# Altium schematic sheet DW1000.SchDoc
size A4
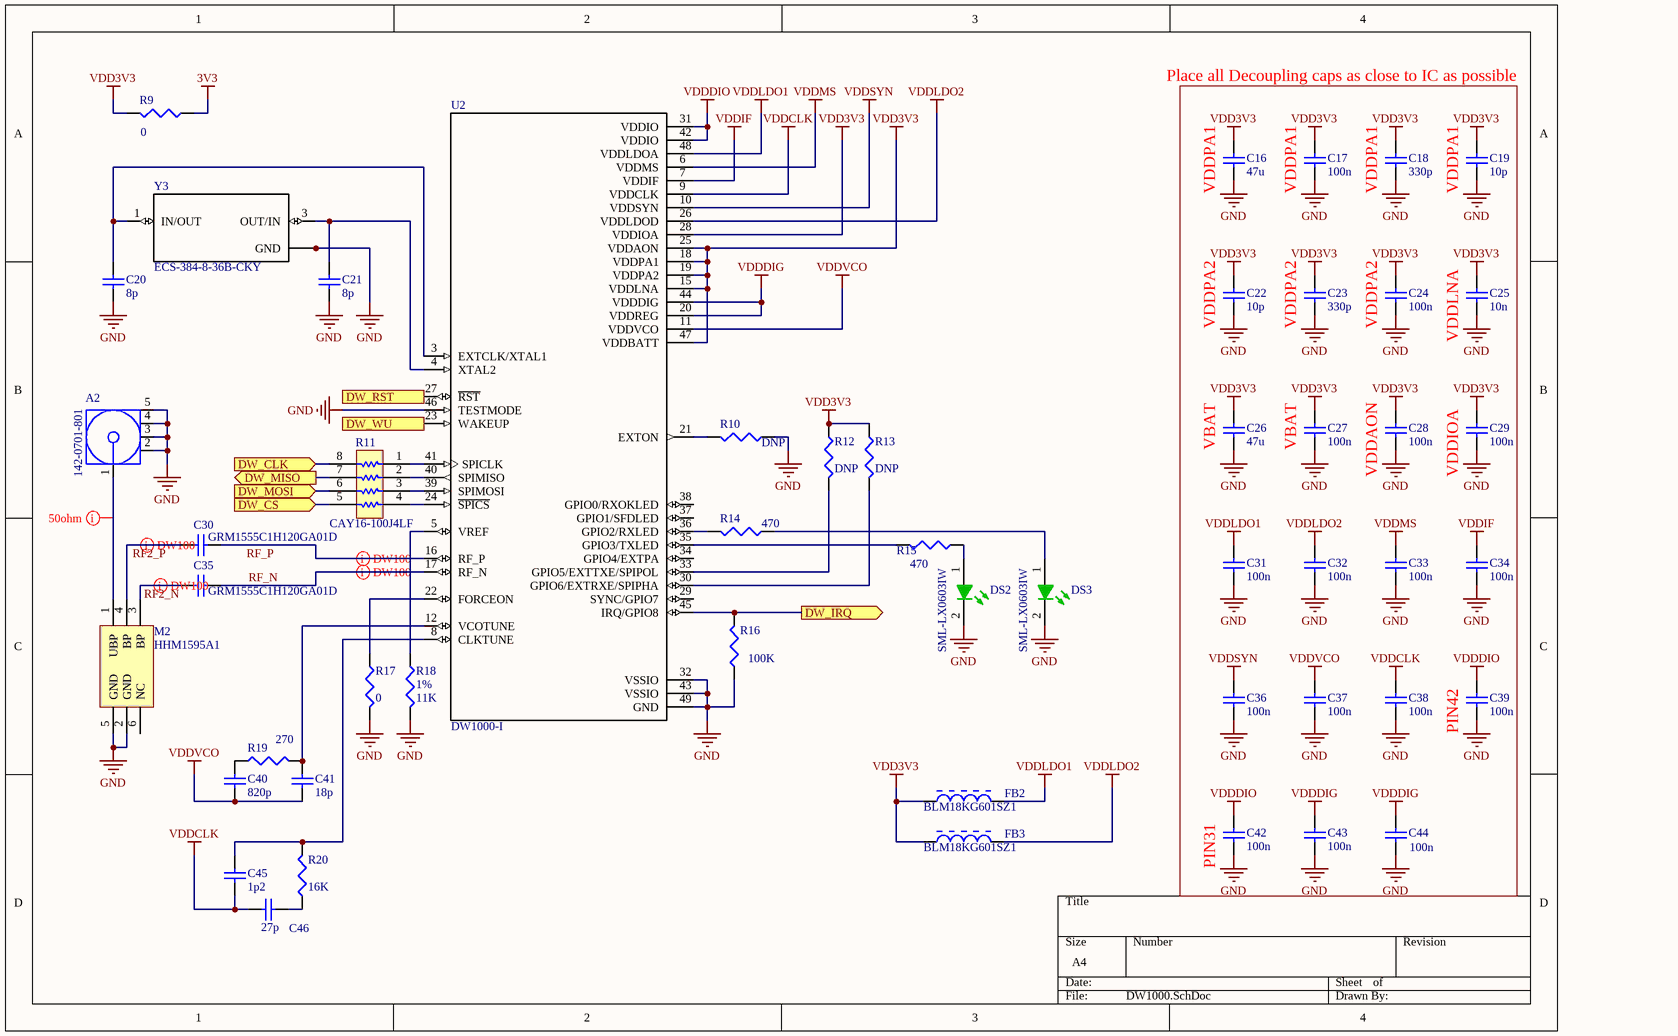
[diagram p0: DW1000.SchDoc]

## Parts
A2  142-0701-801  [CINC-142-0701-801_V]
C16  47u  [CAPC1608X90X35NL10T15]
C17  100n  [CAPC1608X90X35NL10T15]
C18  330p  [CAPC1608X90X35NL10T15]
C19  10p  [CAPC1608X90X35NL10T15]
C20  8p  [CAPC1608X90X35NL10T15]
C21  8p  [CAPC1608X90X35NL10T15]
C22  10p  [CAPC1608X90X35NL10T15]
C23  330p  [CAPC1608X90X35NL10T15]
C24  100n  [CAPC1608X90X35NL10T15]
C25  10n  [CAPC1608X90X35NL10T15]
C26  47u  [CAPC1608X90X35NL10T15]
C27  100n  [CAPC1608X90X35NL10T15]
C28  100n  [CAPC1608X90X35NL10T15]
C29  100n  [CAPC1608X90X35NL10T15]
C30  GRM1555C1H120GA01D  [CAPC1005X55X25ML05T10]
C31  100n  [CAPC1608X90X35NL10T15]
C32  100n  [CAPC1608X90X35NL10T15]
C33  100n  [CAPC1608X90X35NL10T15]
C34  100n  [CAPC1608X90X35NL10T15]
C35  GRM1555C1H120GA01D  [CAPC1005X55X25ML05T10]
C36  100n  [CAPC1608X90X35NL10T15]
C37  100n  [CAPC1608X90X35NL10T15]
C38  100n  [CAPC1608X90X35NL10T15]
C39  100n  [CAPC1608X90X35NL10T15]
C40  820p  [CAPC1608X90X35NL10T15]
C41  18p  [CAPC1608X90X35NL10T15]
C42  100n  [CAPC1608X90X35NL10T15]
C43  100n  [CAPC1608X90X35NL10T15]
C44  100n  [CAPC1608X90X35NL10T15]
C45  1p2  [CAPC1608X90X35NL10T15]
C46  27p  [CAPC1608X90X35NL10T15]
DS2  SML-LX0603IW  [KING-0603LED_GREEN_V]
DS3  SML-LX0603IW  [KING-0603LED_GREEN_V]
FB2  BLM18KG601SZ1  [MURA-BLM18SG-B25-CHIP-2_V1]
FB3  BLM18KG601SZ1  [MURA-BLM18SG-B25-CHIP-2_V1]
M2  HHM1595A1  [TDK-HHM1595A1_V]
R9  value 0  [J1-0603]
R10  value DNP  [J1-0603]
R11  CAY16-100J4LF  [BOUR-CAY16-J4_V]
R12  value DNP  [J1-0603]
R13  value DNP  [J1-0603]
R14  value 470  [J1-0603]
R15  value 470  [J1-0603]
R16  value 100K  [J1-0603]
R17  value 0  [J1-0603]
R18  1%  value 11K  [J1-0603]
R19  value 270  [J1-0603]
R20  value 16K  [J1-0603]
U2  DW1000-I  [*QFN40P600X600X90-49N]
Y3  ECS-384-8-36B-CKY  [*XTAL_ECS-240-8-36-CKM-TR]

## Ports
DW_CLK (in), DW_CS (in), DW_IRQ (out), DW_MISO (out), DW_MOSI (in), DW_RST (in), DW_WU (in)

## Nets
3V3: R9.1
GND: A2.2 A2.3 A2.4 A2.5 C16.1 C17.1 C18.1 C19.1 C20.1 C21.1 C22.1 C23.1 C24.1 C25.1 C26.1 C27.1 C28.1 C29.1 C31.1 C32.1 C33.1 C34.1 C36.1 C37.1 C38.1 C39.1 C42.1 C43.1 C44.1 DS2.2(K) DS3.2(K) M2.2(GND) M2.5(GND) R10.1 R16.1 R17.2 R18.2 U2.32(VSSIO) U2.43(VSSIO) U2.46(TESTMODE) U2.49(GND) Y3.2(GND) Y3.4(GND)
VDD3V3: C16.2 C17.2 C18.2 C19.2 C22.2 C23.2 C24.2 C25.2 C26.2 C27.2 C28.2 C29.2 FB2.1 FB3.1 R9.2 R12.1 R13.1 U2.15(VDDLNA) U2.18(VDDPA1) U2.19(VDDPA2) U2.25(VDDAON) U2.28(VDDIOA) U2.47(VDDBATT)
VDDCLK: C38.2 C45.1 C46.2 U2.9(VDDCLK)
VDDDIG: C43.2 C44.2 U2.20(VDDREG) U2.44(VDDDIG)
VDDDIO: C39.2 C42.2 U2.31(VDDIO) U2.42(VDDIO)
VDDIF: C34.2 U2.7(VDDIF)
VDDLDO1: C31.2 FB2.2 U2.48(VDDLDOA)
VDDLDO2: C32.2 FB3.2 U2.26(VDDLDOD)
VDDMS: C33.2 U2.6(VDDMS)
VDDSYN: C36.2 U2.10(VDDSYN)
VDDVCO: C37.2 C40.1 C41.1 U2.11(VDDVCO)
DW_CLK: R11.8 ; port DW_CLK
DW_CS: R11.5 ; port DW_CS
DW_IRQ: R16.2 U2.45(IRQ/GPIO8) ; port DW_IRQ
DW_MISO: R11.7 ; port DW_MISO
DW_MOSI: R11.6 ; port DW_MOSI
DW_RST: U2.27(~{RST}) ; port DW_RST
DW_WU: U2.23(WAKEUP) ; port DW_WU
RF2_N: C35.1 M2.3(BP)
RF2_P: C30.1 M2.4(BP)
RF_N: C35.2 U2.17(RF_N)
RF_P: C30.2 U2.16(RF_P)
NetA2_1: A2.1 M2.1(UBP)
NetC20_2: C20.2 U2.3(EXTCLK/XTAL1) Y3.1(IN/OUT)
NetC21_2: C21.2 U2.4(XTAL2) Y3.3(OUT/IN)
NetC40_2: C40.2 R19.1
NetC41_2: C41.2 R19.2 U2.12(VCOTUNE)
NetC45_2: C45.2 R20.2 U2.8(CLKTUNE)
NetC46_1: C46.1 R20.1
NetDS2_1: DS2.1(A) R15.1
NetDS3_1: DS3.1(A) R14.1
NetR10_2: R10.2 U2.21(EXTON)
NetR11_1: R11.1 U2.41(SPICLK)
NetR11_2: R11.2 U2.40(SPIMISO)
NetR11_3: R11.3 U2.39(SPIMOSI)
NetR11_4: R11.4 U2.24(~{SPICS})
NetR12_2: R12.2 U2.33(GPIO5/EXTTXE/SPIPOL)
NetR13_2: R13.2 U2.30(GPIO6/EXTRXE/SPIPHA)
NetR14_2: R14.2 U2.36(GPIO2/RXLED)
NetR15_2: R15.2 U2.35(GPIO3/TXLED)
NetR17_1: R17.1 U2.22(FORCEON)
NetR18_1: R18.1 U2.5(VREF)

Not connected (* = marked no-connect by the designer): M2 6(NC); U2 29(SYNC/GPIO7) 34(GPIO4/EXTPA) 37(GPIO1/SFDLED) 38(GPIO0/RXOKLED)

## Layout directives
differential pair; rule Differential Pairs Routing [Pref Gap = 10mil    Min Gap  = 5mil    Max Gap  = 10milPref Width = 15mil    Min Width  = 8.474mil    Max Width  = 15mil]; rule Length Constraint [Min Length = 2mm    Max Length = 4mm]; rule Matched Net Lengths [Tolerance = 0.2mm]; rule Solder Mask Expansion [Expansion = 0.102mm]; rule Width Constraint [Pref Width = 10mil    Min Width = 10mil    Max Width = 10mil]: RF_N, RF_P
rule Width Constraint [Pref Impedance = 50,00ohms    Min Impedance = 50,00ohms    Max Impedance = 50,00ohms]; rule Routing Layers [TopLayer - Enabled BottomLayer - Disabled]; rule Parallel Segment Constraint [Gap = 0.5mm    Limit = 10mm    Layer - Same Layer]; rule Length Constraint [Min Length = 1mm    Max Length = 20mm]: NetA2_1
differential pair; rule Differential Pairs Routing [Pref Gap = 10mil    Min Gap  = 5mil    Max Gap  = 10milPref Width = 15mil    Min Width  = 8.474mil    Max Width  = 15mil]; rule Matched Net Lengths [Tolerance = 0.2mm]; rule Solder Mask Expansion [Expansion = 0.102mm]; rule Width Constraint [Pref Width = 10mil    Min Width = 10mil    Max Width = 10mil]: RF2_N, RF2_P

## Notes on the sheet
- Place all Decoupling caps as close to IC as possible
- (near C16) VDDPA1
- (near C17) VDDPA1
- (near C18) VDDPA1
- (near C19) VDDPA1
- (near C22) VDDPA2
- (near C23) VDDPA2
- (near C24) VDDPA2
- (near C25) VDDLNA
- (near C26) VBAT
- (near C27) VBAT
- (near C28) VDDAON
- (near C29) VDDIOA
- (near C39) PIN42
- (near C42) PIN31

## Library data of the parts
A2 = CMP-2000-05490-1: SMA End Launch Jack Receptacle, 50 Ohm, 0 to 18 GHz, -65 to 165 degC, 5-Pin SMD, RoHS, Bulk; Manufacturer: EmersonConnectivitySolutions; Connector Type: JackPCB; Gender: Jack(Female); Impedance: 50Ohms; Brand: Johnson/EmersonConnectivitySolutions; Body Material: Brass; Body Style: Straight; Maximum Frequency: 18GHz; Factory Pack Quantity: 5; Datasheet URL: https://belfuse.com/resources/Johnson/productinformation/pi-142-0701-801.pdf; Datasheet Version: 12/2014; Operating Temperature Range: -65Cto+165C; Mounting Technology: SurfaceMount; RF Series: SMA; Package Reference: 142-0701-801; Product Category: RFConnectors/CoaxialConnectors; Termination Style: Solder; RoHS: Details; Package URL: https://belfuse.com/resources/Johnson/drawings/dr-1420701801.pdf; Series: SMA; Package Description: 5-Pin Surface Mount Device, Body 14.275 x 9.525 mm; Manufacturer URL: http://www.cinch.com/; Contact Plating: Gold; Product: Connectors; Orientation: Straight
C16-C29 C31-C34 C36-C46 = CMP-2006-02891-1: Part Number: GRM188R71H102KA01D; Manufacturer: Murata
C30 C35 = CMP-2008-03945-1: Manufacturer: Murata; Part Number: GRM1555C1H120GA01D
DS2 DS3 = CMP-0404-00001-1: LED, SMT, 0603(1608), 1.1mm thickness, Green; Manufacturer: Kingbright; PartNumber: KP-1608MGC; Reverse Voltage: 5 V; Power Dissipation: 75 mW; Forward Current: 30 mA; Packing Type: 2000 pcs / reel; Mounting Technology: Surface Mount; Storage Temperature: -40 to +85 degC; ComponentLink1URL: http://www.kingbright.com/; PackageDescription: 2-Pin SMT LED, 1.6 x 0.8 mm Pitch; PackageReference: 0603LED_GREEN; ComponentLink1Description: Manufacturer URL
FB2 FB3 = CMP-0686-00596-2: Chip Ferrite Bead for Power Lines (Low DC Resistance Type), 220 Ohm, 2500 mA, -55 to 125 degC, 1.6 x 0.8 x 0.65 mm SMD, Tape and Reel; Manufacturer: Murata; PartNumber: BLM18SG221TN1D; Impedance (at 100 MHz): 220 Ohm +/- 25%; DC Resistance: 0.040 Ohm Max.; Rated Current: 2500 mA; ComponentLink2Description: Datasheet; ComponentLink1Description: Manufacturer URL; ComponentLink3Description: Package Specification; DatasheetVersion: 08/2013; Packing: Tape and Reel; PackageReference: BLM18_H650-2; PackageDescription: 2-Pin Chip, Body 1.6 x 0.8 mm; Mounting Technology: Surface Mount; Operating Temperature Range: -55 to 125 degC; ComponentLink1URL: http://www.murata.com/; ComponentLink2URL: http://www.murata.com/products/catalog/pdf/c31e.pdf; ComponentLink3URL: http://www.murata.com/products/catalog/pdf/c31e.pdf
M2 = CMP-2000-07459-1: Multilayer Balun, 3000 to 8000 MHz, -40 to 85 degC, 6-Pin SMD, RoHS, Tape and Reel; Manufacturer: TDK; Case\/Package: 0805; Impedance: 100Ohm; Insertion Loss: 1.5dB; Radiation Hardening: No; Number of Pins: 6; Manufacturer URL: http://www.tdk.com/; Min Operating Temperature: -40degC; Mounting Technology: SurfaceMount; RoHSCompliant: true; Package Description: 6-Pin Surface Mount Device, Body 2 x 1.25 mm, Pitch 0.65 mm; Datasheet URL: https://product.tdk.com/info/en/documents/data_sheet/rf_balun_hhm1595a1_en.pdf; Package Quantity: 1; Max Operating Temperature: 85degC; Packaging: TapeandReel; Package Reference: HHM1595A1; Termination: SMD/SMT; Datasheet Version: 04/2015; Case Code (Imperial): 0805; Case Code (Metric): 2012
R9 R10 R12-R20 = Res3: Resistor; Published: 8-Jun-2000; LatestRevisionDate: 29-May-2009; LatestRevisionNote: IPC-7351 Footprint Added.; PackageReference: J1-0603; Publisher: Altium Limited; PackageDescription: Chip Resistor
R11 = CMP-1747-00007-1: Chip Resistor Array, 1 KOhm, +/- 5%, 62.5 mW, -55 to 125 degC, 8-Pin SMD, RoHS, Tape and Reel; Power Rating: 100 mW; Tolerance: 1%; Voltage Rating (DC): 50 V; Resistance: 330 Ohm; Case\Package: 0603; RoHSCompliant: true; Case Code (Metric): 1608; Pins: 2; PackageDescription: 8-Pin Surface Mount Device, Body 1.6 x 3.2 mm, Pitch 0.8 mm; Height: 0.45 mm; Min Operating Temperature: -55 degC; ComponentLink1URL: http://www.bourns.com/; Case Code (Imperial): 0603; Packaging: Tape and Reel; PackageReference: CAY16-J4; ComponentLink1Description: Manufacturer URL; ComponentLink2Description: Datasheet; Length: 1.6 mm; Width: 0.8 mm; Max Operating Temperature: 155 degC; Mount: Surface Mount; DatasheetVersion: Sep-14; Voltage Rating: 50 V; REACH SVHC: No SVHC; ComponentLink2URL: http://www.bourns.com/pdfs/CATCAY.pdf; Package Quantity: 5000
U2 = DW1000-I: Ic Rf Txrx 802.15.4 48-Qfn; MF: Decawave Limited; Price: None; Package: QFN-48 Decawave; Availability: Unavailable; MP: DW1000-I; SnapEDA_Link: https://www.snapeda.com/parts/DW1000-I/Decawave%20Limited/view-part/?ref=snap; Value: *
Y3 = ECS-240-8-36-CKM-TR: The miniature ECX-2236 is a very compact SMD Crystal. The 2.5 x 2.0 x 0.55 mm ceramic package is ideal for today's SMD manufacturing environment.; MF: ECS Inc.; Price: None; SnapEDA_Link: https://www.snapeda.com/parts/ECS-240-8-36-CKM-TR/ECS%20Inc./view-part/?ref=snap; Package: SMD-4 ECS Inc.; Availability: Unavailable; MP: ECS-240-8-36-CKM-TR; Value: *